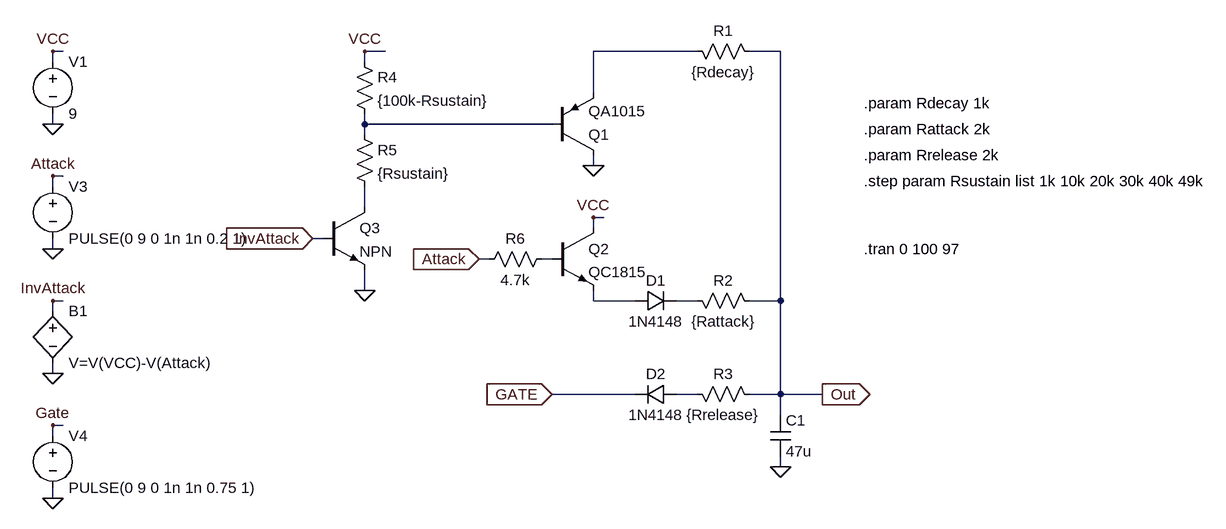
[diagram p0: schematic EG_Analog2_0_analog_9V.asc]
EG_Analog2_0_analog_9V.asc, the LTspice schematic file:
Version 4
SHEET 1 1564 680
WIRE -288 -176 -304 -176
WIRE 208 -176 176 -176
WIRE 688 -176 528 -176
WIRE 816 -176 768 -176
WIRE -304 -160 -304 -176
WIRE 176 -160 176 -176
WIRE 528 -112 528 -176
WIRE -304 -64 -304 -80
WIRE 176 -64 176 -80
WIRE 464 -64 176 -64
WIRE 176 -48 176 -64
WIRE 528 0 528 -16
WIRE -288 16 -304 16
WIRE -304 32 -304 16
WIRE 176 64 176 32
WIRE 544 80 528 80
WIRE 528 96 528 80
WIRE 112 112 96 112
WIRE -304 128 -304 112
WIRE 368 144 352 144
WIRE 464 144 448 144
WIRE 176 192 176 160
WIRE -288 208 -304 208
WIRE 528 208 528 192
WIRE 592 208 528 208
WIRE 688 208 656 208
WIRE 816 208 816 -176
WIRE 816 208 768 208
WIRE -304 224 -304 208
WIRE -304 320 -304 304
WIRE 592 352 464 352
WIRE 688 352 656 352
WIRE 816 352 816 208
WIRE 816 352 768 352
WIRE 880 352 816 352
WIRE 816 384 816 352
WIRE -288 400 -304 400
WIRE -304 416 -304 400
WIRE 816 464 816 448
WIRE -304 512 -304 496
FLAG 96 112 InvAttack
IOPIN 96 112 In
FLAG 528 0 0
FLAG 352 144 Attack
IOPIN 352 144 In
FLAG 464 352 GATE
IOPIN 464 352 In
FLAG 816 464 0
FLAG 528 80 VCC
FLAG 880 352 Out
IOPIN 880 352 Out
FLAG -304 -64 0
FLAG -304 320 0
FLAG -304 -176 VCC
FLAG -304 208 InvAttack
FLAG -304 16 Attack
FLAG -304 128 0
FLAG -304 512 0
FLAG -304 400 Gate
FLAG 176 -176 VCC
FLAG 176 192 0
SYMBOL pnp 464 -16 M180
SYMATTR InstName Q1
SYMATTR Value QA1015
SYMBOL res 672 -192 M90
WINDOW 0 0 56 VBottom 2
WINDOW 3 32 56 VTop 2
SYMATTR InstName R1
SYMATTR Value {Rdecay}
SYMBOL npn 464 96 R0
SYMATTR InstName Q2
SYMATTR Value QC1815
SYMBOL diode 592 224 R270
WINDOW 0 32 32 VTop 2
WINDOW 3 0 32 VBottom 2
SYMATTR InstName D1
SYMATTR Value 1N4148
SYMBOL res 672 192 M90
WINDOW 0 0 56 VBottom 2
WINDOW 3 32 56 VTop 2
SYMATTR InstName R2
SYMATTR Value {Rattack}
SYMBOL diode 656 336 R90
WINDOW 0 0 32 VBottom 2
WINDOW 3 32 32 VTop 2
SYMATTR InstName D2
SYMATTR Value 1N4148
SYMBOL res 672 336 M90
WINDOW 0 0 56 VBottom 2
WINDOW 3 32 56 VTop 2
SYMATTR InstName R3
SYMATTR Value {Rrelease}
SYMBOL cap 800 384 R0
SYMATTR InstName C1
SYMATTR Value 47u
SYMBOL voltage -304 -176 R0
WINDOW 123 0 0 Left 2
WINDOW 39 0 0 Left 2
SYMATTR InstName V1
SYMATTR Value 9
SYMBOL voltage -304 16 R0
WINDOW 123 0 0 Left 2
WINDOW 39 0 0 Left 2
SYMATTR InstName V3
SYMATTR Value PULSE(0 9 0 1n 1n 0.2 1)
SYMBOL voltage -304 400 R0
WINDOW 123 0 0 Left 2
WINDOW 39 0 0 Left 2
SYMATTR InstName V4
SYMATTR Value PULSE(0 9 0 1n 1n 0.75 1)
SYMBOL res 160 -176 R0
SYMATTR InstName R4
SYMATTR Value {100k-Rsustain}
SYMBOL res 160 -64 R0
SYMATTR InstName R5
SYMATTR Value {Rsustain}
SYMBOL npn 112 64 R0
SYMATTR InstName Q3
SYMBOL bv -304 208 R0
SYMATTR InstName B1
SYMATTR Value V=V(VCC)-V(Attack)
SYMBOL res 464 128 R90
WINDOW 0 0 56 VBottom 2
WINDOW 3 32 56 VTop 2
SYMATTR InstName R6
SYMATTR Value 4.7k
TEXT 944 -96 Left 2 !.param Rdecay 1k
TEXT 944 -56 Left 2 !.param Rattack 2k
TEXT 944 -16 Left 2 !.param Rrelease 2k
TEXT 944 128 Left 2 !.tran 0 100 97
TEXT 944 24 Left 2 !.step param Rsustain list 1k 10k 20k 30k 40k 49k

The netlist it stands for:
* EG_Analog2_0_analog_9V.asc
Q1 0 N002 N001 0 QA1015
R1 N001 Out {Rdecay}
Q2 VCC N004 N005 0 QC1815
D1 N005 N006 1N4148
R2 N006 Out {Rattack}
D2 N007 GATE 1N4148
R3 N007 Out {Rrelease}
C1 Out 0 47u
V1 VCC 0 9
V3 Attack 0 PULSE(0 9 0 1n 1n 0.2 1)
V4 GATE 0 PULSE(0 9 0 1n 1n 0.75 1)
R4 VCC N002 {100k-Rsustain}
R5 N002 N003 {Rsustain}
Q3 N003 InvAttack 0 0 NPN
B1 InvAttack 0 V=V(VCC)-V(Attack)
R6 N004 Attack 4.7k
.model D D
.lib standard.dio
.model NPN NPN
.model PNP PNP
.lib standard.bjt
.param Rdecay 1k
.param Rattack 2k
.param Rrelease 2k
.tran 0 100 97
.step param Rsustain list 1k 10k 20k 30k 40k 49k
.backanno
.end